# Altium project Meteo_senzor.PrjPcb
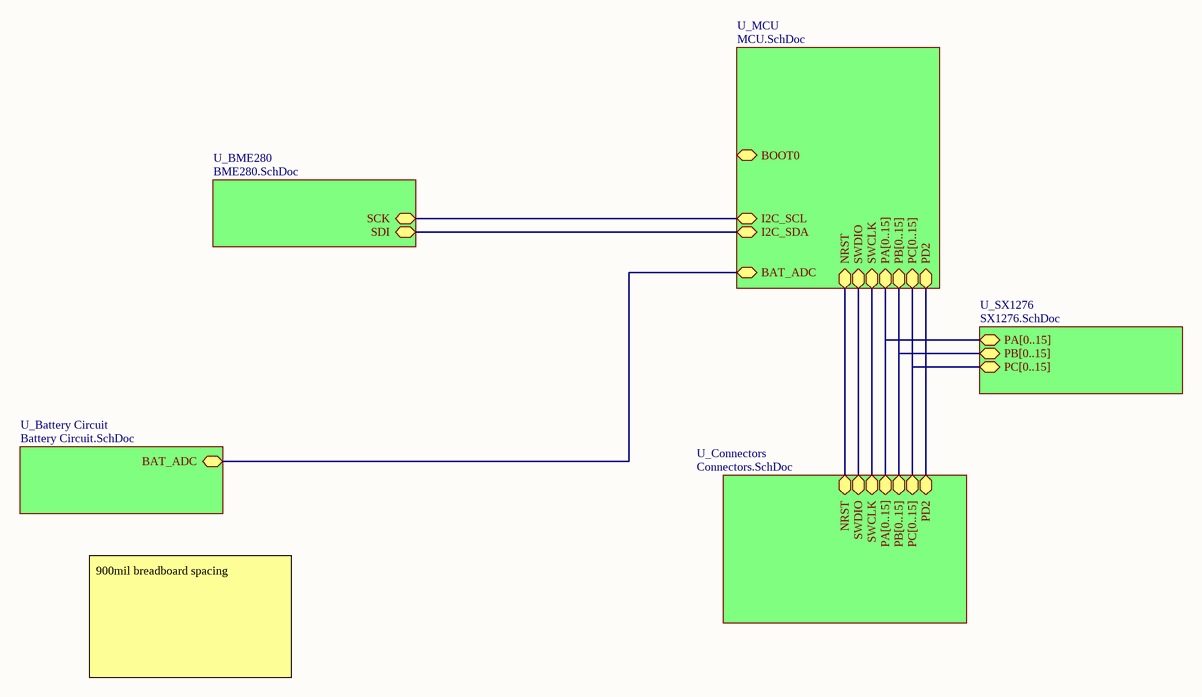
[diagram p0: Top.SchDoc]
6 sheets, 31 parts. Net scope: hierarchical (ports join the sheet entries above them; power ports are global).
Board file: PCB1.PcbDoc
Sheets:
  Top.SchDoc
    U_Battery Circuit = Battery Circuit.SchDoc
    U_MCU = MCU.SchDoc
    U_BME280 = BME280.SchDoc
    U_Connectors = Connectors.SchDoc
    U_SX1276 = SX1276.SchDoc

## Sheet Top.SchDoc: STM32 LoRa Node
size A4; Author: Leon Baždar; CompanyName: FER; Address1: Zagreb; Revision: V1.0; SheetNumber: 1; SheetTotal: 6

### Sub-sheets
U_Battery Circuit = Battery Circuit.SchDoc: BAT_ADC (bidir)
U_BME280 = BME280.SchDoc: SCK (bidir), SDI (bidir)
U_Connectors = Connectors.SchDoc: NRST (bidir), SWDIO (bidir), SWCLK (bidir), PB[0..15] (bidir), PA[0..15] (bidir), PC[0..15] (bidir), PD2 (bidir)
U_MCU = MCU.SchDoc: NRST (bidir), PB[0..15] (bidir), PC[0..15] (bidir), PA[0..15] (bidir), BOOT0 (bidir), SWDIO (bidir), I2C_SCL (bidir), I2C_SDA (bidir), SWCLK (bidir), PD2 (bidir), BAT_ADC (bidir)
U_SX1276 = SX1276.SchDoc: PA[0..15] (bidir), PB[0..15] (bidir), PC[0..15] (bidir)

### Nets
NRST: sheet U_MCU/NRST, sheet U_Connectors/NRST
PA0: sheet U_Battery Circuit/BAT_ADC, sheet U_MCU/BAT_ADC
PA13: sheet U_MCU/SWDIO, sheet U_Connectors/SWDIO
PA14: sheet U_MCU/SWCLK, sheet U_Connectors/SWCLK
PB8: sheet U_MCU/I2C_SCL, sheet U_BME280/SCK
PB9: sheet U_MCU/I2C_SDA, sheet U_BME280/SDI
PD2: sheet U_MCU/PD2, sheet U_Connectors/PD2

### Buses and harness runs
bus sheet U_Connectors/PA[0..15] = sheet U_MCU/PA[0..15] = sheet U_SX1276/PA[0..15]
bus sheet U_Connectors/PB[0..15] = sheet U_MCU/PB[0..15] = sheet U_SX1276/PB[0..15]
bus sheet U_Connectors/PC[0..15] = sheet U_MCU/PC[0..15] = sheet U_SX1276/PC[0..15]

### Notes on the sheet
- 900mil breadboard spacing
- Project:
- File:
- Size:
- A4
- Author:
- Revision:
- Date:
- Sheet
- of

## Sheet Battery Circuit.SchDoc: STM32 LoRa Node
size A4; Author: Leon Baždar; CompanyName: FER; Address1: Zagreb; Revision: V1.0; SheetNumber: 3; SheetTotal: 6
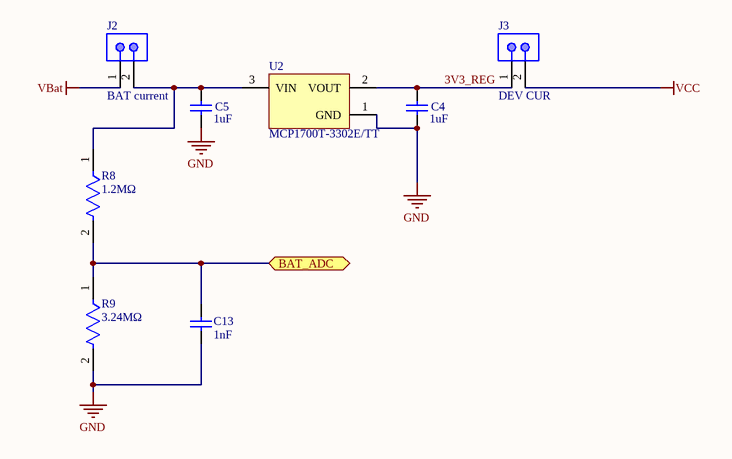
[diagram p1: Battery Circuit.SchDoc]

### Parts
C4  1uF  [CAPC2013X145X50LL20T25]
C5  1uF  [CAPC2013X145X50LL20T25]
C13  1nF  [CAPC1005X55X25LL05T05]
J2  BAT current  [TECO-5-146280-2_V]
J3  DEV CUR  [TECO-5-146280-2_V]
R8  1.2MΩ  [FP-CRCW0603-e3-IPC_A]
R9  3.24MΩ  [FP-CRCW0603-e3-MFG]
U2  MCP1700T-3302E/TT  [SOT-23-TT3_N]

### Ports
BAT_ADC (bidir)

### Nets
GND: C4.2 C5.2 C13.1 R9.2 U2.1(GND)  [project net VSS]
VBat: J2.1
VCC: J3.2
3V3_REG: C4.1 J3.1 U2.2(VOUT)
PA0: C13.2 R8.2 R9.1 ; port BAT_ADC
NetC5_1: C5.1 J2.2 R8.1 U2.3(VIN)

### Notes on the sheet
- Project:
- File:
- Size:
- A4
- Author:
- Revision:
- Date:
- Sheet
- of

### Library data of the parts
C4 C5 = CMP-2007-01016-1: Manufacturer: Kemet; Part Number: C0805C105K4PACTU
C13 = CMP-2008-01229-1: Manufacturer: Vitramon; Part Number: VJ0402Y102KXXCW1BC
J2 J3 = CMP-2000-07492-1: Male Header, Pitch 2.54 mm, 1 x 2 Position, Height 8.21 mm, Tail Length 3.05 mm, -65 to 105 degC, RoHS, Bulk; Manufacturer: TE Connectivity; Mating Connector Lock: No(Without); Number of Positions: 2; Pitch: 2.54mm; PCB Mounting Orientation: Vertical; Keyed: No; Case\/Package: 100; Mating Post Length: 0.23inch; High Temperature Housing: Yes; Max Current Rating: 5A; PCB Thickness: 0.063inch; PCB Mount Retention: Without; Approvals: CSA; Current Rating: 3A; Radiation Hardening: No; Length: 4.67mm; Contact Mating Length: 0.23inch; Connector Type: Header; Number of Rows: 1; Termination Post Length: 0.12inch; Board Standoff: No(Without); Max Operating Temperature: 105degC; Contact Shape: Square; Selectively Loaded: No(Without); Gasket: No(Without); Number of Contacts: 2; Contact Gender: Male; Mating Alignment: No(Without); Manufacturer URL: http://www.te.com/; Datasheet URL: http://www.te.com/commerce/DocumentDelivery/DDEController?Action=showdoc&DocId=Customer+Drawing%7F146280%7FH1%7Fpdf%7FEnglish%7FENG_CD_146280_H1.pdf%7F5-146280-2; Mount: ThroughHole; Orientation: Straight; Packaging: Carton; Package Reference: 5-146280-2; Package Quantity: 500; Stabilizers: No(Without); Row Spacing: 2.54mm; Contact Material: CopperAlloy; Panel Mount Retention: No(Without); Datasheet Version: Rev. H1, 08/2016; Housing Colour: Black; Colour: Black; Package Description: Male Header, Pitch 2.54 mm, 1 x 2 Position, Height 8.21 mm, Tail Length 3.05 mm; Contact Plating: Matte; Housing Material: Polymer; Contact Protection: No(Without); Min Operating Temperature: -65degC; Mounting Technology: ThroughHole; Flammability Rating: UL94V-0; RoHSCompliant: true; Termination: ThroughHole; Depth: 2.34mm; High Speed Serial Data Connector: No
R8 = CMP-2000-03023-2: RES Thick Film, 1.2MΩ, 1%, 0.1W, 100ppm/°C, 0603; Resistance: 1.2MR; Voltage Rating: 75V; Power Rating: 100mW; Weight: 7.1E-05oz; Tolerance: 1%; Lead Free: Lead Free; Contact Plating: Tin; Height: 0.45mm; Number of Terminations: 2; Depth: 0.85mm; Temperature Coefficient: 100ppm/°C; Voltage Rating (DC): 75V; Package Quantity: 10; Termination: SMD/SMT; Case Code (Metric): 1608; Width: 0.033inch; Radiation Hardening: No; Min Operating Temperature: -55°C; Military Standard: Not; Packaging: Tape and Reel; Number of Pins: 2; Features: Automotive AEC-Q200; Case/Package: 0603; Case Code (Imperial): 0603; Max Power Dissipation: 100mW; Composition: Thick Film; Max Operating Temperature: 155°C; Length: 1.55mm
R9 = CMP-2000-03317-2: RES Thick Film, 3.24MΩ, 1%, 0.1W, 100ppm/°C, 0603; Max Power Dissipation: 100mW; Voltage Rating (DC): 75V; Resistance: 3.24MR; Radiation Hardening: No; Features: Automotive AEC-Q200; Composition: Thick Film; Case Code (Imperial): 0603; Tolerance: 1%; Case Code (Metric): 1608; Height: 0.02inch; Length: 1.55mm; Temperature Coefficient: 100ppm/°C; Package Quantity: 10; Max Operating Temperature: 155°C; Lead Free: Lead Free; Military Standard: Not; Packaging: Tape and Reel; Width: 0.033inch; Weight: 7.1E-05oz; Voltage Rating: 75V; Power Rating: 100mW; Number of Terminations: 2; Min Operating Temperature: -55°C; Case/Package: 0603; Contact Plating: Tin; Depth: 0.85mm
U2 = CMP-0136-00791-1: Low Quiescent Current LDO, 3-Pin SOT-23, Extended Temperature, Tape and Reel; PackageVersion: revBB, Aug-2009; Code_IPC: SOT23-3; PackageReference: SOT-23-TT3; DatasheetVersion: revB, Feb-2007; PackageDescription: 3-Lead Plastic Small Outline Transistor (TT) [SOT-23]

## Sheet MCU.SchDoc: STM32 LoRa Node
size A4; Author: Leon Baždar; CompanyName: FER; Address1: Zagreb; Revision: V1.0; SheetNumber: 2; SheetTotal: 6
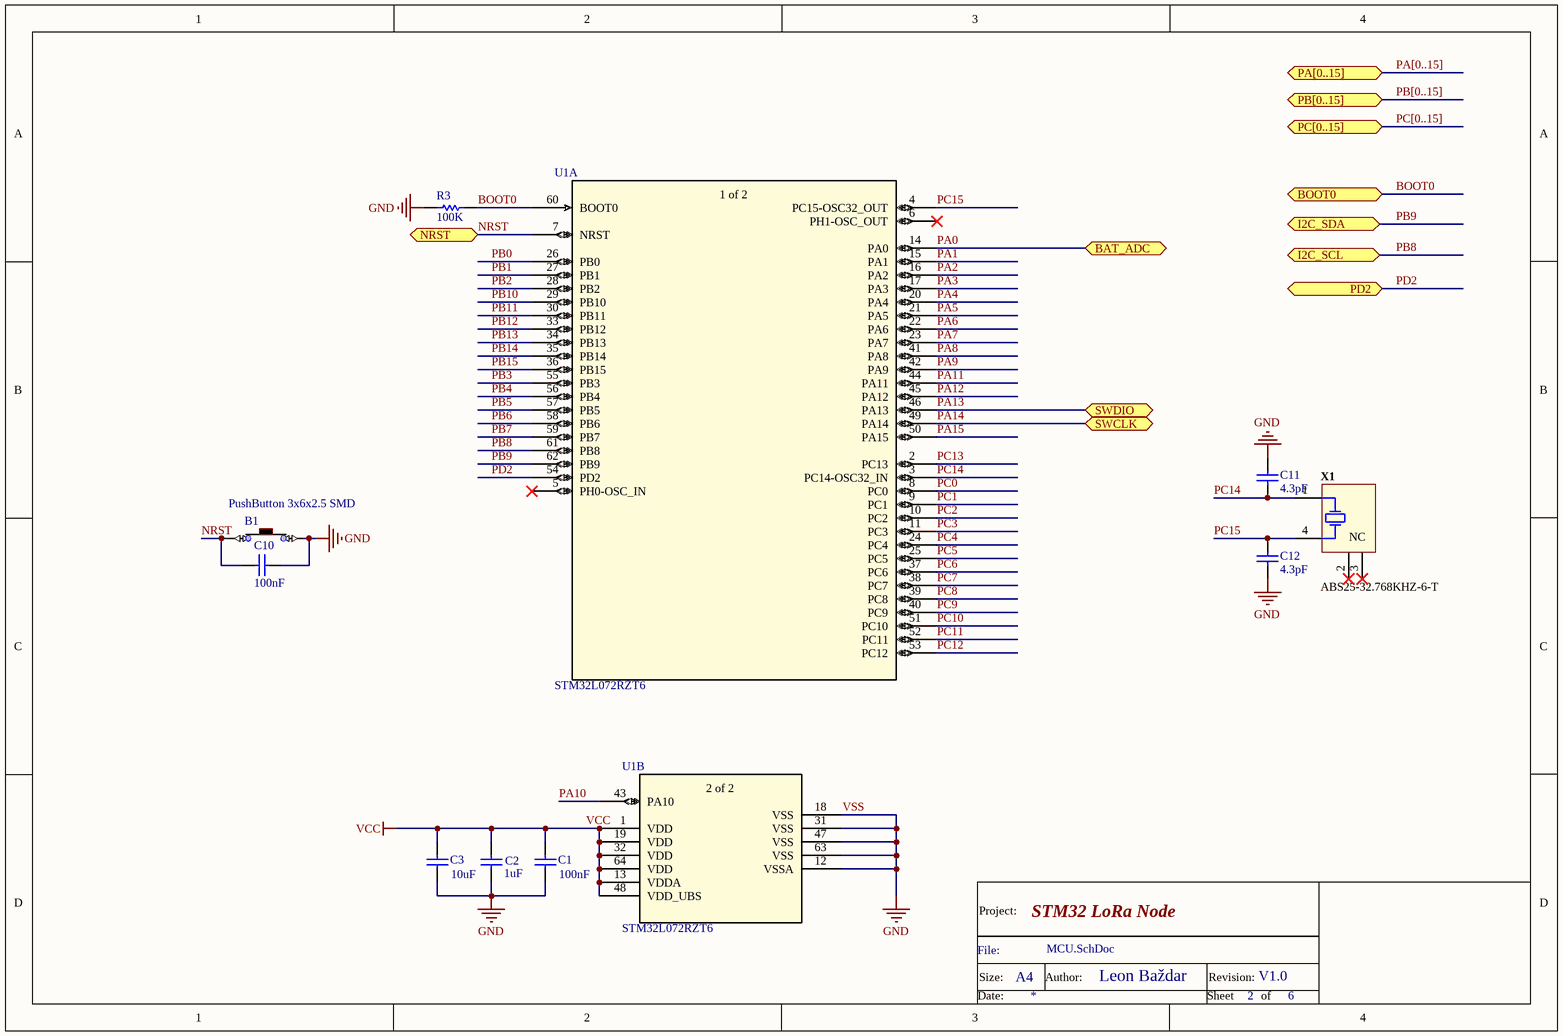
[diagram p2: MCU.SchDoc]

### Parts
B1  PushButton 3x6x2.5 SMD  [PushButton 3x6x2.5 SMD-Footprint-1]
C1  100nF  [CAPC1005X56X25LL10T15]
C2  1uF  [CAPC2013X145X50LL20T25]
C3  10uF  [CAPC2013X145X20ML20]
C10  100nF  [CAPC1608X90X20LL10]
C11  4.3pF  [CAPC1608X90X35LL10T15]
C12  4.3pF  [CAPC1608X90X35LL10T15]
R3  100K  [RESC1005X40X25ML05T05]
U1  STM32L072RZT6  [LQFP64-10x10mm]  (parts A,B of 2)
X1  ABS25-32.768KHZ-6-T  [ABRA-ABS25-4_V]

### Ports
BAT_ADC (bidir), BOOT0 (bidir), I2C_SCL (bidir), I2C_SDA (bidir), NRST (bidir), PA[0..15] (bidir), PB[0..15] (bidir), PC[0..15] (bidir), PD2 (bidir), SWCLK (bidir), SWDIO (bidir)

### Nets
VCC: C1.1 C2.1 C3.2 U1.1(VDD) U1.13(VDDA) U1.19(VDD) U1.32(VDD) U1.48(VDD_UBS) U1.64(VDD)
VSS: B1.2(b2) C1.2 C2.2 C3.1 C10.2 C11.2 C12.1 R3.1 U1.12(VSSA) U1.18(VSS) U1.31(VSS) U1.47(VSS) U1.63(VSS)  [also labelled GND]
BOOT0: R3.2 U1.60(BOOT0) ; port BOOT0
NRST: B1.1(b1) C10.1 U1.7(NRST) ; port NRST
PA0: U1.14(PA0) ; port BAT_ADC
PA1: U1.15(PA1)
PA2: U1.16(PA2)
PA3: U1.17(PA3)
PA4: U1.20(PA4)
PA5: U1.21(PA5)
PA6: U1.22(PA6)
PA7: U1.23(PA7)
PA8: U1.41(PA8)
PA9: U1.42(PA9)
PA10: U1.43(PA10)
PA11: U1.44(PA11)
PA12: U1.45(PA12)
PA13: U1.46(PA13) ; port SWDIO
PA14: U1.49(PA14) ; port SWCLK
PA15: U1.50(PA15)
PB0: U1.26(PB0)
PB1: U1.27(PB1)
PB2: U1.28(PB2)
PB3: U1.55(PB3)
PB4: U1.56(PB4)
PB5: U1.57(PB5)
PB6: U1.58(PB6)
PB7: U1.59(PB7)
PB8: U1.61(PB8) ; port I2C_SCL
PB9: U1.62(PB9) ; port I2C_SDA
PB10: U1.29(PB10)
PB11: U1.30(PB11)
PB12: U1.33(PB12)
PB13: U1.34(PB13)
PB14: U1.35(PB14)
PB15: U1.36(PB15)
PC0: U1.8(PC0)
PC1: U1.9(PC1)
PC2: U1.10(PC2)
PC3: U1.11(PC3)
PC4: U1.24(PC4)
PC5: U1.25(PC5)
PC6: U1.37(PC6)
PC7: U1.38(PC7)
PC8: U1.39(PC8)
PC9: U1.40(PC9)
PC10: U1.51(PC10)
PC11: U1.52(PC11)
PC12: U1.53(PC12)
PC13: U1.2(PC13)
PC14: C11.1 U1.3(PC14-OSC32_IN) X1.1(X1)
PC15: C12.2 U1.4(PC15-OSC32_OUT) X1.4(X2)
PD2: U1.54(PD2) ; port PD2

Not connected (* = marked no-connect by the designer): U1 5(PH0-OSC_IN)* 6(PH1-OSC_OUT)*; X1 2(NC)* 3(NC)*

### Buses and harness runs
bus PA[0..15] = port PA[0..15]
bus PB[0..15] = port PB[0..15]
bus PC[0..15] = port PC[0..15]

### Notes on the sheet
- Project:
- File:
- Size:
- A4
- Author:
- Revision:
- Date:
- Sheet
- of
- (in symbol STM32L072RZT6, part A) 1 of 2
- (in symbol STM32L072RZT6, part B) 2 of 2

### Library data of the parts
B1 = CMP-011-00013-4
C1 = CMP-2008-02842-1: Part Number: 0402YD104KAT2A; Manufacturer: AVX Interconnect / Elco
C2 = CMP-2007-01016-1: as C4 on sheet Battery Circuit
C3 = CMP-2000-05452-1: Multilayer Ceramic Chip Capacitor, 10 uF, +/- 10%, 10 V, -55 to 125 degC, 0805 (2012 Metric), RoHS, Tape and Reel; Manufacturer: TDK; PCN Part Number: MLCCPartNumberChange30/Nov/2012; Capacitance: 10µF; Voltage - Rated: 10V; Product Training Modules: CSeriesGeneralApplicationsSEAT,CCV,andTVCLDesignToolsGuidetoReplacinganElectrolyticCapacitorwithanMLCC; Online Catalog: CSeries,GeneralPurpose; Other Names: 445-6857-6; Temperature Coefficient: X7R; Features: -; Ratings: -; Operating Temperature: -55degC~125degC; RoHS Information: RoHSCertificate-MLCC; Datasheet Version: Mar-15; Package / Case: 0805(2012Metric); Series: C; Mounting Type: SurfaceMount,MLCC; Family: CeramicCapacitors; Height - Seated (Max): -; Manufacturer URL: http://www.tdk.com/; Packaging: Digi-Reel; Tolerance: ±10%; Category: Capacitors; Applications: GeneralPurpose; Standard Package: 1; Size / Dimension: 0.079"Lx0.049"W(2.00mmx1.25mm); Datasheet URL: http://download.siliconexpert.com/pdfs/2015/4/21/15/54/45/779/tdk_/manual/37024850441143360mlcc_commercial_general_en.pdf; Lead Style: -; Lead Spacing: -; Thickness (Max): 0.057"(1.45mm); Package Reference: 805; Package Description: 2-Pin Surface Mount Device, Body 2 x 1.25 mm
C10 = CMP-2000-07546-1: Chip Capacitor, 0.1 uF, +/- 10%, 50 V, -55 to 125 degC, 0603 (1608 Metric), RoHS, Tape and Reel; Manufacturer: TDK; Voltage: 50V; Dielectric: X7R; Package Reference: 603; Radiation Hardening: No; Composition: Ceramic; Datasheet URL: https://product.tdk.com/info/en/catalog/datasheets/mlcc_automotive_general_en.pdf; Mounting Technology: SurfaceMount; Datasheet Version: 12/2014; Width: 0.8mm; Length: 1.6mm; Capacitance: 100nF; Tolerance: 10%; Case Code (Imperial): 0603; RoHSCompliant: True; Min Operating Temperature: -55degC; Package Description: 2-Pin Surface Mount Device, Body 1.6 x 0.8 mm; Packaging: TapeandReel; Package Quantity: 1; Voltage Rating: 50V; Mount: SurfaceMount; Lead Free: LeadFree; Depth: 0.8mm; Termination: SMD/SMT; Case Code (Metric): 1608; Thickness: 0.035inch; Height: 0.8mm; Weight: 7.1E-05oz; Voltage Rating (DC): 50V; REACH SVHC: NoSVHC; Manufacturer URL: http://www.tdk.com/; Case/Package: 0603; Max Operating Temperature: 125degC
C11 C12 = CMP-2006-02448-1: Part Number: GQM1885C2A4R3BB01D; Manufacturer: Murata
R3 = CMP-2002-08123-2: Chip Resistor, 100 KOhm, +/- 1%, 0.63 W, -55 to 155 degC, 0402 (1005 Metric), RoHS, Tape and Reel; Voltage Rating: 50 V; Type (Resistor): Thick Film; Power Rating: 63 mW; Case\Package: 0402; Mount: Surface Mount; Packaging: Tape and Reel; Weight: 2.3E-05 oz; PackageDescription: 2-Pin Surface Mount Device, Body 1 x 0.5 mm; ComponentLink1Description: Manufacturer URL; ComponentLink2Description: Datasheet; Min Operating Temperature: -55 degC; Width: 0.5 mm; Resistance: 100 kohm; REACH SVHC: Unknown; ComponentLink2URL: http://www.vishay.com/docs/20035/dcrcwe3.pdf; Package Quantity: 10000; Mounting Technology: Surface Mount; PackageReference: 0402; ComponentLink1URL: http://www.vishay.com/; Max Operating Temperature: 155 degC; Length: 1 mm; DatasheetVersion: 06/2012; Height: 0.35 mm; Case Code (Imperial): 0402; Pins: 2; Tolerance: 1%; Case Code (Metric): 1005; Radiation Hardening: No; RoHSCompliant: true
U1 = STM32L072RZT6: No Description Available; SourceLibrary: Updates_to_database_2020-10-19; Built_By: EMA_UL_Team; Vendor: STMicroelectronics; Copyright: Copyright (C) 2018 Accelerated Designs. All rights reserved; Manufacturer_Part_Number: STM32L072RZT6; RefDes: RefDes; Type: DEV
X1 = CMP-2000-05036-1: Low Frequency Crystal, 32.768 KHz, 6 pF, +/- 20 ppm, -40 to 85 degC, 4-Pin SMD, RoHS, Tape and Reel; Manufacturer: Abracon; Tolerance: 20PPM; ESR: 50kOhms; Case Width: 3.8mm; Case Height: 2.5mm; Case Length: 8mm; Load Capacitance: 6pF; Operating Temperature Range: -40Cto+85C; Package Reference: ABS25; Factory Pack Quantity: 3000; Package Description: 4-Pin Surface Mount Device, Body 8 x 3.8 mm, Pitch 5.5 mm; Frequency: 32.768kHz; Termination Style: SMD/SMT; Manufacturer URL: http://www.abracon.com/; Type: LowFrequencyCrystal; Dimensions: 3.8mmWx8mmLx2.5mmH; Product Category: Crystals; Series: ABS25; RoHS: Details; Package / Case: 8mmx3.8mm; Datasheet Version: Jun-17; Brand: ABRACON; Datasheet URL: https://datasheet.ciiva.com/854/abs25-854528.pdf; Packaging: Reel; Mounting Style: SMD/SMT

## Sheet BME280.SchDoc: STM32 LoRa Node
size A4; Author: Leon Baždar; CompanyName: FER; Address1: Zagreb; Revision: V1.0; SheetNumber: 4; SheetTotal: 6
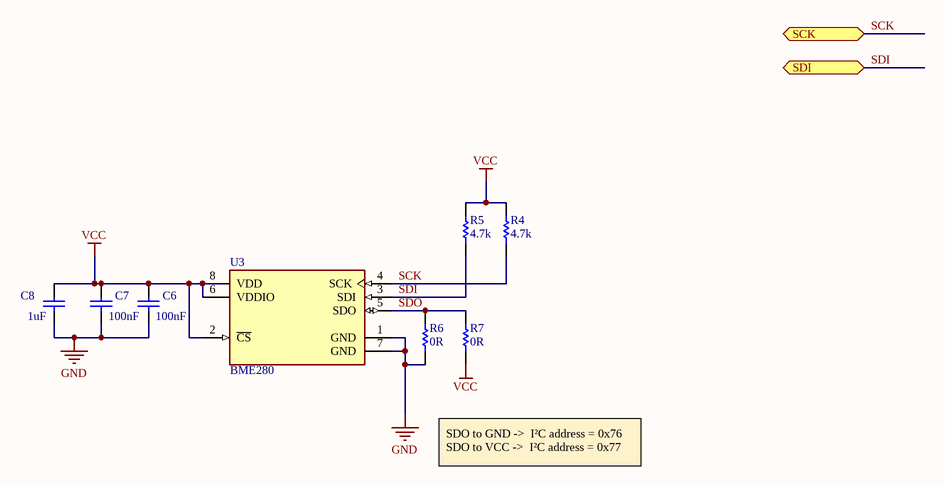
[diagram p3: BME280.SchDoc]

### Parts
C6  100nF  [CAPC1005X56X25LL10T15]
C7  100nF  [CAPC1005X56X25LL10T15]
C8  1uF  [CAPC2013X145X50LL20T25]
R4  4.7k  [RESC1005X40X25LL05T05]
R5  4.7k  [RESC1005X40X25LL05T05]
R6  0R  [RESC1005X40X25ML05T10]
R7  0R  [RESC1005X40X25ML05T10]
U3  BME280  [FP-BME280-MFG]

### Ports
SCK (bidir), SDI (bidir)

### Nets
GND: C6.2 C7.2 C8.2 R6.1 U3.1(GND) U3.7(GND)  [project net VSS]
VCC: C6.1 C7.1 C8.1 R4.2 R5.2 R7.1 U3.2(~{CS}) U3.6(VDDIO) U3.8(VDD)
SCK: R4.1 U3.4(SCK) ; port SCK  [project net PB8]
SDI: R5.1 U3.3(SDI) ; port SDI  [project net PB9]
SDO: R6.2 R7.2 U3.5(SDO)

### Notes on the sheet
- SDO to GND ->  I²C address = 0x76
  SDO to VCC ->  I²C address = 0x77
- Project:
- File:
- Size:
- A4
- Author:
- Revision:
- Date:
- Sheet
- of

### Library data of the parts
C6 C7 = CMP-2008-02842-1: as C1 on sheet MCU
C8 = CMP-2007-01016-1: as C4 on sheet Battery Circuit
R4 R5 = CMP-1665-00031-3: Chip Resistor, 4.7 KOhm, +/- 1%, 0.1 W, -55 to 155 degC, 0402 (1005 Metric), RoHS, Tape and Reel; PartNumber: ERJ-2RKF4701X; Voltage Rating: 50 V; Case\/Package: 0402; Power Rating: 100 mW; Height: 0.35 mm; Mounting Technology: Surface Mount; REACH SVHC: Yes; Resistance: 4.7 KOhm; Max Operating Temperature: 155 degC; ComponentLink1Description: Manufacturer URL; ComponentLink2Description: Datasheet; Pins: 2; PackageReference: 0402; Tolerance: 1%; Case Code (Imperial): 0402; Length: 1 mm; PackageDescription: 2-Pin Surface Mount Device, Body 1 x 0.5 mm; RoHSCompliant: true; Package Quantity: 1; Radiation Hardening: No; DatasheetVersion: 04/2015; Width: 0.5 mm; Case Code (Metric): 1005; Mount: Surface Mount; ComponentLink1URL: http://www.panasonic.com/; Min Operating Temperature: -55 degC; Packaging: Cut Tape; ComponentLink2URL: http://industrial.panasonic.com/cdbs/www-data/pdf/RDA0000/AOA0000C86.pdf
R6 R7 = CMP-2002-08060-1: Manufacturer: Yageo / Phycomp; Part Number: RC0402JR-130RL
U3 = CMP-191074-000001-1: SENSOR PRESSURE HUMIDITY TEMP; Output Type: SPI; Sensor Type: Temperature; Response Time: 1s; Accuracy: 3%; Packaging: Cut Tape; Lead Free: Lead Free; Number of Pins: 8; Min Operating Temperature: -40°C; Max Operating Temperature: 85°C; Mount: Surface Mount; Case/Package: LGA

## Sheet Connectors.SchDoc: STM32 LoRa Node
size A4; Author: Leon Baždar; CompanyName: FER; Address1: Zagreb; Revision: V1.0; SheetNumber: 5; SheetTotal: 6
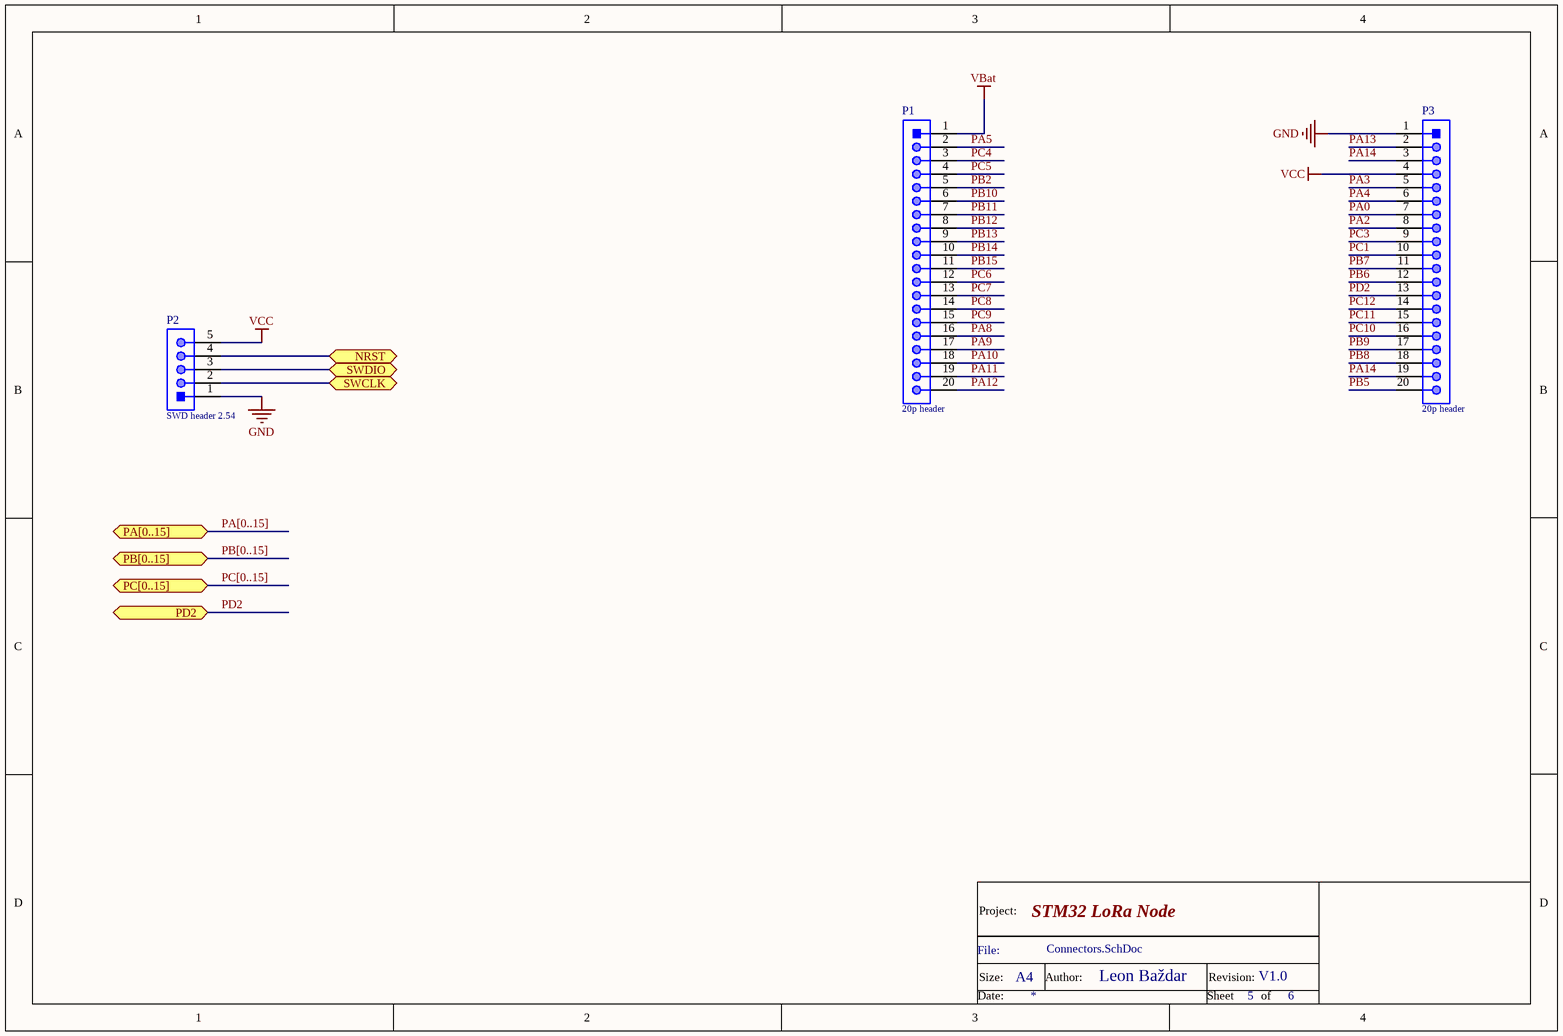
[diagram p4: Connectors.SchDoc]

### Parts
P1  20p header  [61302011121]
P2  SWD header 2.54  [61300511121]
P3  20p header  [61302011121]

### Ports
NRST (bidir), PA[0..15] (bidir), PB[0..15] (bidir), PC[0..15] (bidir), PD2 (bidir), SWCLK (bidir), SWDIO (bidir)

### Nets
GND: P2.1 P3.1  [project net VSS]
VBat: P1.1
VCC: P2.5 P3.4
NRST: P2.4 ; port NRST
PA0: P3.7
PA2: P3.8
PA3: P3.5
PA4: P3.6
PA5: P1.2
PA8: P1.16
PA9: P1.17
PA10: P1.18
PA11: P1.19
PA12: P1.20
PA13: P2.3 P3.2 ; port SWDIO
PA14: P2.2 P3.3 P3.19 ; port SWCLK
PB2: P1.5
PB5: P3.20
PB6: P3.12
PB7: P3.11
PB8: P3.18
PB9: P3.17
PB10: P1.6
PB11: P1.7
PB12: P1.8
PB13: P1.9
PB14: P1.10
PB15: P1.11
PC1: P3.10
PC3: P3.9
PC4: P1.3
PC5: P1.4
PC6: P1.12
PC7: P1.13
PC8: P1.14
PC9: P1.15
PC10: P3.16
PC11: P3.15
PC12: P3.14
PD2: P3.13 ; port PD2

### Buses and harness runs
bus PA[0..15] = port PA[0..15]
bus PB[0..15] = port PB[0..15]
bus PC[0..15] = port PC[0..15]

### Notes on the sheet
- Project:
- File:
- Size:
- A4
- Author:
- Revision:
- Date:
- Sheet
- of

### Library data of the parts
P1 P3 = CMP-1502-01102-1: THT Vertical Pin Header WR-PHD, Pitch 2.54 mm, Single Row, 20 pins; Manufacturer: Wurth Elektronik; Withstanding Voltage: 500VAC; Gender: Male; Pin Number: 20; Rated Current: 3A; Contact Resistance: 20mOhm; Pitch: 2.54mm; Working Voltage: 250VAC; Publisher: WurthElektronik; Packaging: Bag; Datasheet URL: https://katalog.we-online.de/em/datasheet/6130xx11121.pdf; Row Number: Single; Mounting Technology: THT; Manufacturer URL: http://www.we-online.de; Orientation: Vertical; Package Reference: 61302011121; Part Number: 61302011121; Operating Temperature: -40to105degC
P2 = CMP-1502-01068-1: THT Vertical Pin Header WR-PHD, Pitch 2.54 mm, Single Row, 5 pins; Manufacturer: Wurth Elektronik; Pin Number: 5; Contact Resistance: 20mOhm; Working Voltage: 250VAC; Pitch: 2.54mm; Withstanding Voltage: 500VAC; Rated Current: 3A; Gender: Male; Datasheet URL: https://katalog.we-online.de/em/datasheet/6130xx11121.pdf; Orientation: Vertical; Mounting Technology: THT; Row Number: Single; Package Reference: 61300511121; Publisher: WurthElektronik; Part Number: 61300511121; Packaging: Bag; Manufacturer URL: http://www.we-online.de; Operating Temperature: -40to105degC

## Sheet SX1276.SchDoc: STM32 LoRa Node
size A4; Author: Leon Baždar; CompanyName: FER; Address1: Zagreb; Revision: V1.0; SheetNumber: 6; SheetTotal: 6
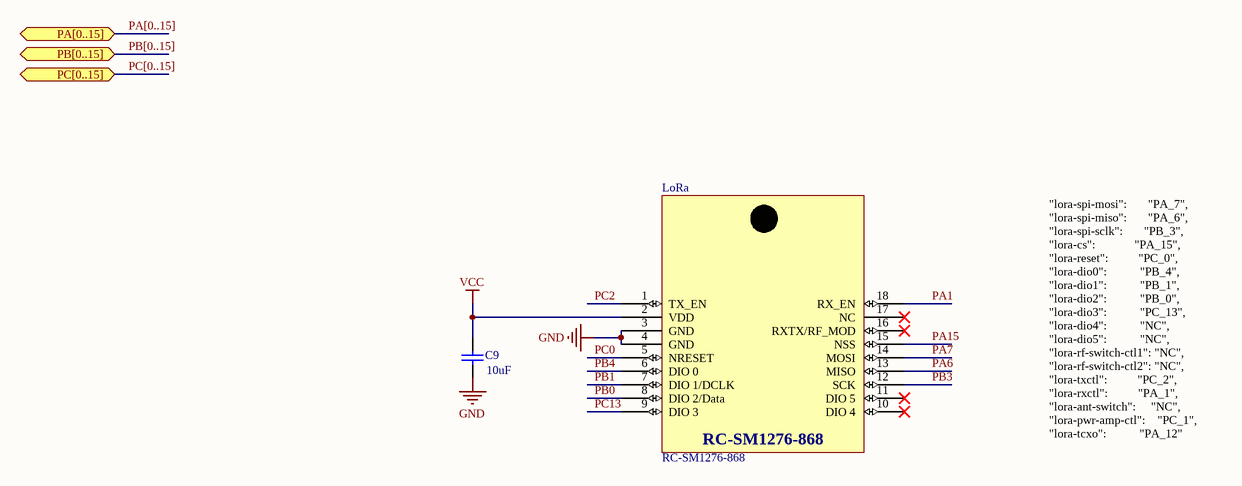
[diagram p5: SX1276.SchDoc]

### Parts
C9  10uF  [CAPC2013X145X20ML20]
LoRa  RC-SM1276-868  [RC-SM1276-868]

### Ports
PA[0..15] (bidir), PB[0..15] (bidir), PC[0..15] (bidir)

### Nets
GND: C9.1 LoRa.3(GND) LoRa.4(GND)  [project net VSS]
VCC: C9.2 LoRa.2(VDD)
PA1: LoRa.18(RX_EN)
PA6: LoRa.13(MISO)
PA7: LoRa.14(MOSI)
PA15: LoRa.15(NSS)
PB0: LoRa.8(DIO_2/Data)
PB1: LoRa.7(DIO_1/DCLK)
PB3: LoRa.12(SCK)
PB4: LoRa.6(DIO_0)
PC0: LoRa.5(NRESET)
PC2: LoRa.1(TX_EN)
PC13: LoRa.9(DIO_3)

Not connected (* = marked no-connect by the designer): LoRa 10(DIO_4)* 11(DIO_5)* 16(RXTX/RF_MOD)* 17(NC)*

### Buses and harness runs
bus PA[0..15] = port PA[0..15]
bus PB[0..15] = port PB[0..15]
bus PC[0..15] = port PC[0..15]

### Notes on the sheet
- "lora-spi-mosi":       "PA_7",
  "lora-spi-miso":       "PA_6",
  "lora-spi-sclk":       "PB_3",
  "lora-cs":             "PA_15",
  "lora-reset":          "PC_0",
  "lora-dio0":           "PB_4",
  "lora-dio1":           "PB_1",
  "lora-dio2":           "PB_0",
  "lora-dio3":           "PC_13",
  "lora-dio4":           "NC",
  "lora-dio5":           "NC",
  "lora-rf-switch-ctl1": "NC",
  "lora-rf-switch-ctl2": "NC",
  "lora-txctl":          "PC_2",
  "lora-rxctl":          "PA_1",
  "lora-ant-switch":     "NC",
  "lora-pwr-amp-ctl":    "PC_1",
  "lora-tcxo":           "PA_12"
- Project:
- File:
- Size:
- A4
- Author:
- Revision:
- Date:
- Sheet
- of

### Library data of the parts
C9 = CMP-2000-05452-1: as C3 on sheet MCU; Features: -; Ratings: -; Operating Temperature: -55degC~125degC; RoHS Information: RoHSCertificate-MLCC; Datasheet Version: Mar-15; Package / Case: 0805(2012Metric); Series: C; Mounting Type: SurfaceMount,MLCC; Family: CeramicCapacitors; Height - Seated (Max): -; Manufacturer URL: http://www.tdk.com/; Packaging: Digi-Reel; Tolerance: ±10%; Category: Capacitors; Applications: GeneralPurpose; Standard Package: 1; Size / Dimension: 0.079"Lx0.049"W(2.00mmx1.25mm); Datasheet URL: http://download.siliconexpert.com/pdfs/2015/4/21/15/54/45/779/tdk_/manual/37024850441143360mlcc_commercial_general_en.pdf; Lead Style: -; Lead Spacing: -; Thickness (Max): 0.057"(1.45mm); Package Reference: 805; Package Description: 2-Pin Surface Mount Device, Body 2 x 1.25 mm
LoRa = CMP-021-00007-1: https://www.radiocontrolli.com/it/componente/97/rc-sm1276-868; Min Supply Voltage: 1.8V; Max Supply Voltage: 3.7V; Pins: 18; Min Operating Temperature: -40°C; Max Operating Temperature: 85°C; Mounting Technology: SMT

## Nets that join several sheets
VBat: Battery Circuit (J2.1), Connectors (P1.1)
VCC: Battery Circuit (J3.2), MCU (9 pins), BME280 (9 pins), Connectors (P2.5 P3.4), SX1276 (C9.2 LoRa.2)
VSS: Battery Circuit (5 pins), MCU (13 pins), BME280 (6 pins), Connectors (P2.1 P3.1), SX1276 (C9.1 LoRa.3 LoRa.4)
NRST: MCU (B1.1 C10.1 U1.7), Connectors (P2.4)
PA0: Battery Circuit (C13.2 R8.2 R9.1), MCU (U1.14), Connectors (P3.7)
PA1: MCU (U1.15), SX1276 (LoRa.18)
PA2: MCU (U1.16), Connectors (P3.8)
PA3: MCU (U1.17), Connectors (P3.5)
PA4: MCU (U1.20), Connectors (P3.6)
PA5: MCU (U1.21), Connectors (P1.2)
PA6: MCU (U1.22), SX1276 (LoRa.13)
PA7: MCU (U1.23), SX1276 (LoRa.14)
PA8: MCU (U1.41), Connectors (P1.16)
PA9: MCU (U1.42), Connectors (P1.17)
PA10: MCU (U1.43), Connectors (P1.18)
PA11: MCU (U1.44), Connectors (P1.19)
PA12: MCU (U1.45), Connectors (P1.20)
PA13: MCU (U1.46), Connectors (P2.3 P3.2)
PA14: MCU (U1.49), Connectors (P2.2 P3.3 P3.19)
PA15: MCU (U1.50), SX1276 (LoRa.15)
PB0: MCU (U1.26), SX1276 (LoRa.8)
PB1: MCU (U1.27), SX1276 (LoRa.7)
PB2: MCU (U1.28), Connectors (P1.5)
PB3: MCU (U1.55), SX1276 (LoRa.12)
PB4: MCU (U1.56), SX1276 (LoRa.6)
PB5: MCU (U1.57), Connectors (P3.20)
PB6: MCU (U1.58), Connectors (P3.12)
PB7: MCU (U1.59), Connectors (P3.11)
PB8: MCU (U1.61), BME280 (R4.1 U3.4), Connectors (P3.18)
PB9: MCU (U1.62), BME280 (R5.1 U3.3), Connectors (P3.17)
PB10: MCU (U1.29), Connectors (P1.6)
PB11: MCU (U1.30), Connectors (P1.7)
PB12: MCU (U1.33), Connectors (P1.8)
PB13: MCU (U1.34), Connectors (P1.9)
PB14: MCU (U1.35), Connectors (P1.10)
PB15: MCU (U1.36), Connectors (P1.11)
PC0: MCU (U1.8), SX1276 (LoRa.5)
PC1: MCU (U1.9), Connectors (P3.10)
PC2: MCU (U1.10), SX1276 (LoRa.1)
PC3: MCU (U1.11), Connectors (P3.9)
PC4: MCU (U1.24), Connectors (P1.3)
PC5: MCU (U1.25), Connectors (P1.4)
PC6: MCU (U1.37), Connectors (P1.12)
PC7: MCU (U1.38), Connectors (P1.13)
PC8: MCU (U1.39), Connectors (P1.14)
PC9: MCU (U1.40), Connectors (P1.15)
PC10: MCU (U1.51), Connectors (P3.16)
PC11: MCU (U1.52), Connectors (P3.15)
PC12: MCU (U1.53), Connectors (P3.14)
PC13: MCU (U1.2), SX1276 (LoRa.9)
PD2: MCU (U1.54), Connectors (P3.13)

## Assembly variants
Meteo_senzor I2C 0x76: not fitted R7
Meteo_senzor I2C 0x77: not fitted R6